# EAGLE design Sensor-board (EAGLE 7.2.0)
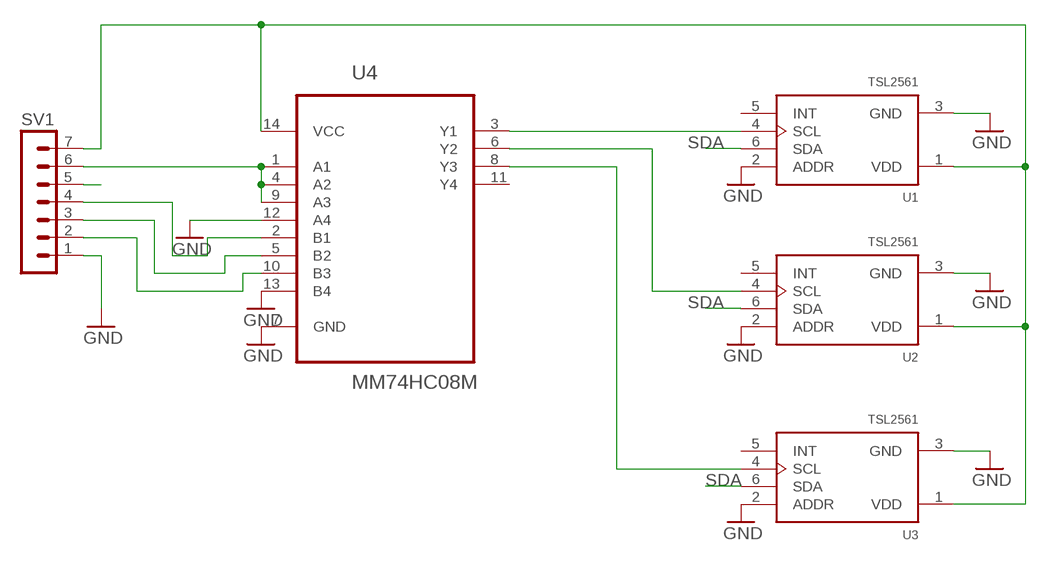
[diagram p0: schematic, sheet 1]

## Parts
SV1  MA07-1  [MA07-1]
U1  TSL2561  [TMB-6]
U2  TSL2561  [TMB-6]
U3  TSL2561  [TMB-6]
U4  MM74HC08M  [SOIC127P600X175-14N]

## Nets
GND: SV1.1 U1.2(ADDR) U1.3(GND) U2.2(ADDR) U2.3(GND) U3.2(ADDR) U3.3(GND) U4.7(GND) U4.12(A4) U4.13(B4)
N$1: U2.4(SCL) U4.6(Y2)
N$2: U3.4(SCL) U4.8(Y3)
N$4: U1.4(SCL) U4.3(Y1)
N$6: SV1.4 U4.2(B1)
N$7: SV1.3 U4.5(B2)
N$8: SV1.2 U4.10(B3)
SCL: SV1.6 U4.1(A1) U4.4(A2) U4.9(A3)
SDA: SV1.5 U1.6(SDA) U2.6(SDA) U3.6(SDA)
VCC: SV1.7 U1.1(VDD) U2.1(VDD) U3.1(VDD) U4.14(VCC)
Unconnected: U1.5(INT) U2.5(INT) U3.5(INT) U4.11(Y4)

## Library data of the parts
SV1 = con-lstb:MA07-1: PIN HEADER; OC_FARNELL: unknown; OC_NEWARK: unknown
U1-U3 = eagle-library-edeca.net-v5:TSL256*: Texas Instruments TSL2560 (SMBus), TSL2561 (I2C) Light-to-digital converter; INTERFACE: I2C
U4 = Fairchild_By_element14_Batch_1:MM74HC08M: Quad 2-Input AND Gate; MPN: MM74HC08M; OC_FARNELL: 1013957; OC_NEWARK: 78K6057; PACKAGE: SOIC-14; SUPPLIER: Fairchild

## Board
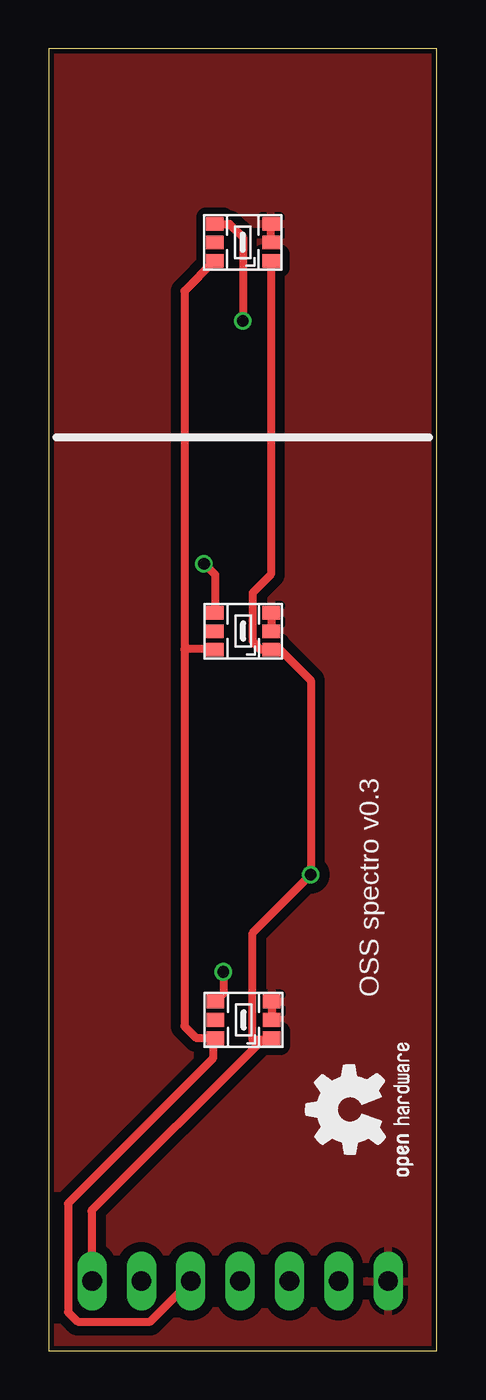
[diagram p1: board, top side]
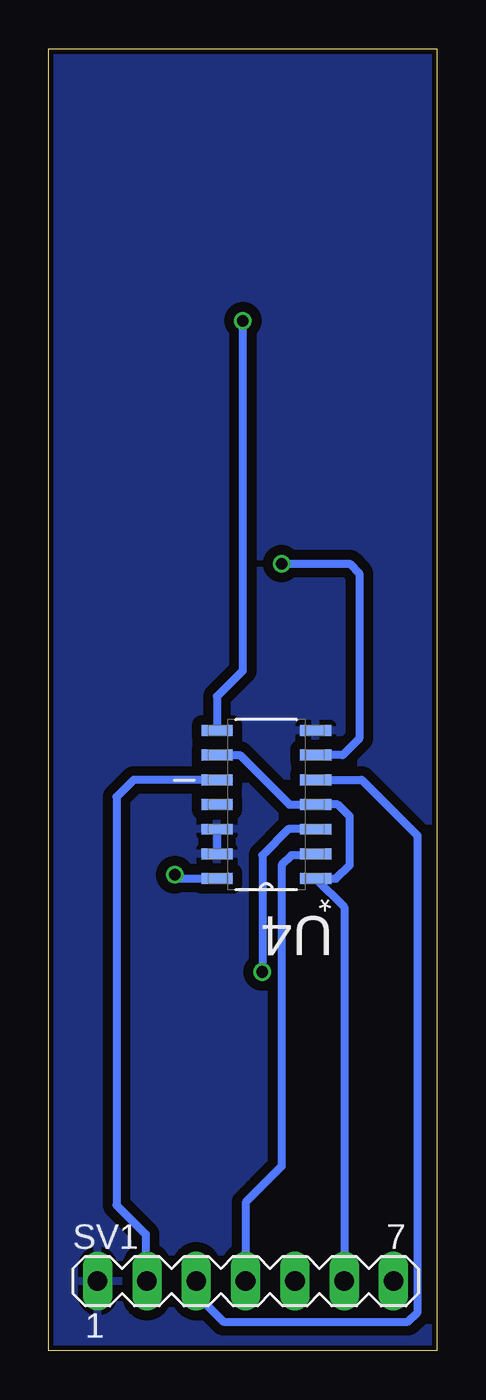
[diagram p2: board, bottom side, seen from below]

Size 20 x 67 mm. Coordinates in mm from the lower left corner, seen from the top.
Outline: 0,0 20,0 20,67 0,67 0,0
Copper layers (1*16): Top 0.035mm / dielectric 1.5mm / Bottom 0.035mm
Design rules "SeeedStudio_2layer_DRU_no_angle_20140221 *": minimum track width 6mil, minimum drill 12mil, track to track 0.5mm, track to pad 6mil, pad to pad 6mil, via to via 6mil, smd to smd 0mil, copper to edge 10mil, drill to drill 10mil, minimum pad ring 10mil, minimum via ring 6mil, stop-mask expansion 2mil, vias tented up to drill 100mil, thermal gap 10mil

### Footprints (pad centres in the part's own frame; a part is rotated, then mirrored left to right if it is on the bottom)
MA07-1 = drill 1.016 long: 1 -7.62,0; 2 -5.08,0; 3 -2.54,0; 4 0,0; 5 2.54,0; 6 5.08,0; 7 7.62,0
TMB-6 = smd 0.9 x 0.7: 1 -1.45,0.95; 2 -1.45,0; 3 -1.45,-0.95; 4 1.45,-0.95; 5 1.45,0; 6 1.45,0.95
SOIC127P600X175-14N = smd 1.6 x 0.559: 1 -2.54,3.81; 2 -2.54,2.54; 3 -2.54,1.27; 4 -2.54,0; 5 -2.54,-1.27; 6 -2.54,-2.54; 7 -2.54,-3.81; 8 2.54,-3.81; 9 2.54,-2.54; 10 2.54,-1.27; 11 2.54,0; 12 2.54,1.27; 13 2.54,2.54; 14 2.54,3.81

### Placement (x,y rotation side)
SV1  9.86,3.59 0 bottom
U1  10.04,17.03 180 top
U2  10.02,37.03 180 top
U3  10,57.03 180 top
U4  8.79,28.11 180 bottom
U$1  [OSHW2]  19.8,8.6 90 top

### Tracks (layer width: path | path; a pad name or v marks a point on that pad's centre or on a via)
GND
  Top 0.406: U3.2 U3.3 | U2.3 U2.2 | U1.3 U1.2
  Bottom 0.406: U4.12 U4.13
  pour Top: -0.5,67.5 20.5,67.5 20.5,67 20.5,-1 -0.5,-1
  pour Bottom: -0.5,67.5 21,67.5 21,-1 -0.5,-1
N$1  (via drill 0.6)
  Top 0.406: v8,40.5 8.57,39.93 U2.4
  Bottom 0.406: v8,40.5 4.5,40.5 4,40 4,31.5 4.85,30.65 U4.6
N$2  (via drill 0.6)
  Top 0.406: U3.4 9.32,57.98 10,57.3 v10,53
  Bottom 0.406: U4.8 11.33,33.67 10,35 v10,53
N$4  (via drill 0.6)
  Top 0.406: v9,19.5 9,18.39 U1.4
  Bottom 0.406: U4.3 7.66,26.84 9,25.5 v9,19.5
N$6
  Bottom 0.406: U4.2 6.32,25.5 7.5,25.5 8,25 8,9.5 9.86,7.64 SV1.4
N$7
  Bottom 0.406: U4.5 3.88,29.38 1,26.5 1,2 1.5,1.5 11,1.5 12.4,2.9 SV1.3
N$8
  Bottom 0.406: U4.10 15.62,29.38 16.5,28.5 16.5,7.5 15,6 15,3.65 SV1.2
SCL
  Bottom 0.406: U4.9 10.15,30.65 7.61,28.11 U4.4 5.11,28.11 4.5,27.5 4.5,25 5.2,24.3 U4.1 4.78,22.83 SV1.6
SDA
  Top 0.406: 7,36.1 7,54.53 U3.6 | 7,36.1 7,16.7 7.62,16.08 U1.6 8.49,15.98 8.49,15.08 1,7.59 1,2 1.5,1.5 5.23,1.5 SV1.5 | U2.6 8.55,36.1 7,36.1
VCC  (via drill 0.6)
  Top 0.406: U1.1 11.31,16 11,16 | U3.1 11.45,39.95 10.5,39 10.5,36.5 10.92,36.08 U2.1 11.77,36.23 13.5,34.5 v13.5,24.5 10.5,21.5 10.5,16 11,16 | SV1.7 2.24,7.16 2.2,7.2 11,16
  Bottom 0.406: v13.5,24.5 13.3,24.3 U4.14

### Text on the board
tNames: OSS spectro v0.3